# Altium schematic sheet Passvies.SchDoc
size A; SheetNumber: 17; SheetTotal: 17
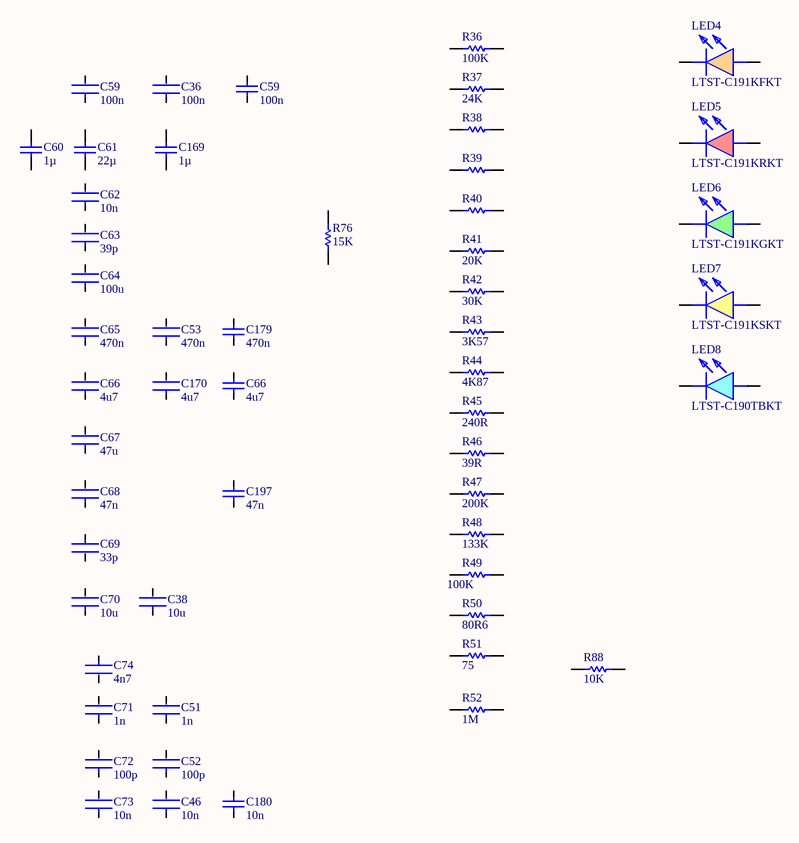
[diagram p0: Passvies.SchDoc]

## Parts
(Parts that share a designator on the sheet are numbered #1, #2 ... from top to bottom, then left to right.)
C36  value 100n  [FP-C1005-050-0_05-IPC_C]  (hidden comment: C1005X7R1H104K050BB)
C38  value 10u  [FP-C1608-080-0_1-IPC_B]  (hidden comment: C1608JB0J106K080AB)
C46  value 10n  [FP-C1005-050-0_05-IPC_C]  (hidden comment: C1005X7S2A103K050BB)
C51  value 1n  [FP-C1005-050-0_05-IPC_C]  (hidden comment: C1005C0G2A102J050BC)
C52  value 100p  [FP-C1005-050-0_05-IPC_C]  (hidden comment: C1005C0G1H101J050BA)
C53  value 470n  [FP-C1005-050-0_05-IPC_C]  (hidden comment: C1005X5R1E474K050BB)
C59#1  value 100n  [FP-C1005-050-0_05-IPC_B]  (hidden comment: C1005X7R1H104K050BB)
C59#2  value 100n  [FP-C1005-050-0_05-IPC_C]  (hidden comment: C1005X7R1H104K050BB)
C60  value 1µ  [CAPC1005X55X10NL05]  (hidden comment: C1005X5R1A105K050BB)
C61  value 22µ  [CAPC1608X100X20NL10]  (hidden comment: C1608X5R0J226M080AC)
C62  value 10n  [FP-C1005-050-0_05-IPC_B]  (hidden comment: C1005X7R1H103K050BB)
C63  value 39p  [FP-C1005-050-0_05-IPC_B]  (hidden comment: C1005C0G1H390J050BA)
C64  value 100u  [FP-C3216-160-0_3-IPC_B]  (hidden comment: C3216X5R0G107M160AB)
C65  value 470n  [FP-C1005-050-0_05-IPC_B]  (hidden comment: C1005X5R1E474K050BB)
C66#1  value 4u7  [FP-C1005-050-0_20-0_10-MFG]  (hidden comment: C1005X5R1A475K050BE)
C66#2  value 4u7  [FP-C1005-050-0_20-0_10-IPC_C]  (hidden comment: C1005X5R1A475K050BE)
C67  value 47u  [FP-C2012-125-0_2-IPC_B]  (hidden comment: C2012X5R1A476M125AC)
C68  value 47n  [FP-C1005-050-0_05-IPC_B]  (hidden comment: C1005X7R1H473K050BB)
C69  value 33p  [FP-C1005-050-0_05-IPC_C]  (hidden comment: C1005NP01H330J050BA)
C70  value 10u  [FP-C1608-080-0_1-IPC_B]  (hidden comment: C1608JB0J106K080AB)
C71  value 1n  [FP-C1005-050-0_05-IPC_B]  (hidden comment: C1005C0G2A102J050BC)
C72  value 100p  [FP-C1005-050-0_05-MFG]  (hidden comment: C1005C0G1H101J050BA)
C73  value 10n  [FP-C1005-050-0_05-IPC_B]  (hidden comment: C1005X7S2A103K050BB)
C74  value 4n7  [FP-C1005-050-0_05-IPC_B]  (hidden comment: C1005X7R1H472K050BA)
C169  value 1µ  [CAPC1005X55X10NL05]  (hidden comment: C1005X5R1A105K050BB)
C170  value 4u7  [FP-C1005-050-0_20-0_10-IPC_C]  (hidden comment: C1005X5R1A475K050BE)
C179  value 470n  [FP-C1005-050-0_05-IPC_C]  (hidden comment: C1005X5R1E474K050BB)
C180  value 10n  [FP-C1005-050-0_05-IPC_C]  (hidden comment: C1005X7S2A103K050BB)
C197  value 47n  [FP-C1005-050-0_05-IPC_C]  (hidden comment: C1005X7R1H473K050BB)
LED4  LTST-C191KFKT  [LEDC1608X55N]
LED5  LTST-C191KRKT  [LEDC1608X55N]
LED6  LTST-C191KGKT  [LEDC1608X55N]
LED7  LTST-C191KSKT  [LEDC1608X65N]
LED8  LTST-C190TBKT  [LEDC1608X65N]
R36  value 100K  [RESC1005X40X25NL05T10]  (hidden comment: RC0402FR-07100KL)
R37  value 24K  [RESC1005X40X25LL05T10]  (hidden comment: RC0402FR-0724KL)
R38  RC0402FR-074K99L  [RESC1005X40X25LL05T10]  (value not drawn)
R39  RC0402FR-072K2L  [RESC1005X40X25NL05T10]  (value not drawn)
R40  RC0402FR-071K3L  [RESC1005X40X25ML05T10]  (value not drawn)
R41  value 20K  [RESC1005X40X25LL05T10]  (hidden comment: RC0402FR-0720KL)
R42  value 30K  [RESC1005X40X25LL05T10]  (hidden comment: RC0402FR-0730KL)
R43  value 3K57  [RESC1005X40X25NL05T10]  (hidden comment: RC0402FR-073K57L)
R44  value 4K87  [RESC1005X40X25LL05T10]  (hidden comment: RC0402FR-074K87L)
R45  value 240R  [RESC0402(1005)_N]  (hidden comment: RC0402FR-07240RL)
R46  value 39R  [RESC1005X40X25LL05T10]  (hidden comment: RC0402FR-0739RL)
R47  value 200K  [RESC1005X40X25LL05T10]  (hidden comment: RC0402FR-07200KL)
R48  value 133K  [RESC1005X40X25ML05T10]  (hidden comment: RC0402FR-07133KL)
R49  value 100K  [RESC1005X40X25NL05T10]  (hidden comment: RC0402FR-07100KL)
R50  value 80R6  [RESC1005X40X25LL05T10]  (hidden comment: RC0402FR-0780R6L)
R51  value 75  [RESC1005X40X25LL05T10]  (hidden comment: RC0402FR-0775RL)
R52  value 1M  [RESC1005X40X25NL05T10]  (hidden comment: RC0402FR-071ML)
R76  value 15K  [RESC1005X40X25NL05T10]  (hidden comment: RC0402FR0715KL)
R88  value 10K  [RESC1005X40X25LL05T10]  (hidden comment: RC0402FR-0710KL)

## Nets

Not connected (* = marked no-connect by the designer): C36 1 2; C38 1 2; C46 1 2; C51 1 2; C52 1 2; C53 1 2; C59#1 1 2; C59#2 1 2; C60 1 2; C61 1 2; C62 1 2; C63 1 2; C64 1 2; C65 1 2; C66#1 1 2; C66#2 1 2; C67 1 2; C68 1 2; C69 1 2; C70 1 2; C71 1 2; C72 1 2; C73 1 2; C74 1 2; C169 1 2; C170 1 2; C179 1 2; C180 1 2; C197 1 2; LED4 1(K) 2(A); LED5 1(K) 2(A); LED6 1(K) 2(A); LED7 1(K) 2(A); LED8 1(K) 2(A); R36 1 2; R37 1 2; R38 1 2; R39 1 2; R40 1 2; R41 1 2; R42 1 2; R43 1 2; R44 1 2; R45 1 2; R46 1 2; R47 1 2; R48 1 2; R49 1 2; R50 1 2; R51 1 2; R52 1 2; R76 1 2; R88 1 2

## Library data of the parts
C36 C59#1 = CMP-2000-05393-2: Multilayer Ceramic Capacitors 100nF ±10% 50V X7R SMD 0402; Voltage: 50V; Dielectric Material: Ceramic; Min Operating Temperature: -55°C; Depth: 0.5mm; Radiation Hardening: No; RoHS Compliant: Yes; Voltage Rating (DC): 50V; Lead Free: Lead Free; Resistor Type: Ceramic; Height: 0.5mm; Dielectric: X7R; Thickness: 0.022inch; Case/Package: 0402; Case Code (Metric): 1005; Termination: SMD/SMT; Packaging: Tape and Reel; Max Operating Temperature: 125°C; Mount: Surface Mount; Package Quantity: 1; Width: 0.02inch; Weight: 2.3E-05oz; Voltage Rating: 50V; Tolerance: 10%; Construction: Flat; Case Code (Imperial): 0402; Length: 1mm; REACH SVHC: No SVHC; Series: C; Part Number: C1005X7R1H104K050BB
C38 C70 = CMP-08246-004001-1: Multilayer Ceramic Capacitors 10μF ±10% 6.3V JB SMD 0603; Case Code (Imperial): 0603; Thickness: 0.035inch; Min Operating Temperature: -25°C; Termination: SMD/SMT; Lead Free: Lead Free; Resistor Type: Ceramic; Width: 0.8mm; Voltage Rating (DC): 6.3V; Package Quantity: 4000; Tolerance: 10%; Length: 0.063inch; Series: C; Height: 0.8mm; Max Operating Temperature: 85°C; Mount: Surface Mount; RoHS Compliant: Yes; Voltage Rating: 6.3V; Case Code (Metric): 1608; Dielectric Material: Ceramic; Case/Package: 0603; Packaging: Tape and Reel
C46 C73 = CMP-08246-005668-1: Multilayer Ceramic Capacitors 10nF ±10% 100V X7S SMD 0402; Dissipation Factor: 5%; Case Code (Imperial): 0402; Packaging: Tape and Reel; Voltage Rating (DC): 100V; Max Operating Temperature: 125°C; Min Operating Temperature: -55°C; Case Code (Metric): 1005; Weight: 2.3E-05oz; Length: 1mm; Width: 0.02inch; Tolerance: 10%; Series: C; Package Quantity: 1; RoHS Compliant: Yes; Voltage: 100V; Resistor Type: Ceramic; Number of Pins: 2; Mount: Surface Mount; Height: 0.5mm; Termination: SMD/SMT; Dielectric: X7S; Dielectric Material: Ceramic; Thickness: 0.022inch; REACH SVHC: No SVHC; Lead Free: Lead Free; Voltage Rating: 100V; Case/Package: 0402; Depth: 0.5mm; Part: *
C51 C71 = CMP-08246-005584-1: Multilayer Ceramic Capacitors 1nF ±5% 100V C0G SMD 0402; Voltage Rating: 100V; Termination: SMD/SMT; Width: 0.5mm; Packaging: Tape and Reel; Max Operating Temperature: 125°C; Length: 0.039inch; Case Code (Metric): 1005; Dielectric: C0G; Height: 0.5mm; Package Quantity: 10000; Weight: 2.3E-05oz; Thickness: 0.022inch; Case/Package: 0402; RoHS Compliant: Yes; Case Code (Imperial): 0402; Min Operating Temperature: -55°C; Mount: Surface Mount; Voltage Rating (DC): 100V; Tolerance: 5%; Part Number: C1005C0G2A102J050BC
C52 C72 = CMP-2000-05991-2: Multilayer Ceramic Capacitors 100pF ±5% 50V C0G SMD 0402; Temperature Coefficient: 30ppm/°C; Packaging: Tape and Reel; Number of Pins: 2; Construction: Flat; Max Operating Temperature: 125°C; Depth: 0.5mm; Radiation Hardening: No; Length: 1mm; Mount: Surface Mount; Thickness: 0.022inch; RoHS Compliant: Yes; Width: 0.5mm; Termination: SMD/SMT; Min Operating Temperature: -55°C; Case/Package: 0402; Tolerance: 5%; Height: 0.5mm; Dielectric: C0G; REACH SVHC: No SVHC; Case Code (Imperial): 0402; Dielectric Material: Ceramic; Voltage Rating: 50V; Package Quantity: 1; Voltage Rating (DC): 50V; Weight: 2.3E-05oz; Series: C; Case Code (Metric): 1005; Voltage: 50V; Lead Free: Lead Free
C53 C65 = CMP-2000-06003-2: Multilayer Ceramic Capacitors 470nF ±10% 25V X5R SMD 0402; Dissipation Factor: 10%; Case Code (Metric): 1005; RoHS Compliant: Yes; Lead Free: Lead Free; Length: 1mm; Case/Package: 0402; Termination: SMD/SMT; Voltage Rating: 25V; Dielectric Material: Ceramic; Dielectric: X5R; Depth: 0.5mm; Series: C; Voltage: 25V; Tolerance: 10%; Packaging: Tape and Reel; Resistor Type: Ceramic; Min Operating Temperature: -55°C; Width: 0.02inch; Thickness: 500um; Package Quantity: 10000; Case Code (Imperial): 0402; Construction: Flat; Height: 0.5mm; REACH SVHC: No SVHC; Radiation Hardening: No; Weight: 2.3E-05oz; Mount: Surface Mount; Voltage Rating (DC): 25V; Max Operating Temperature: 85°C; Part Number: C1005X5R1E474K050BB
C59#2 = C1005X7R1H104K050BB: Multilayer Ceramic Capacitors 100nF ±10% 50V X7R SMD 0402; Voltage: 50V; Dielectric Material: Ceramic; Min Operating Temperature: -55°C; Depth: 0.5mm; Radiation Hardening: No; RoHS Compliant: Yes; Voltage Rating (DC): 50V; Lead Free: Lead Free; Resistor Type: Ceramic; Height: 0.5mm; Dielectric: X7R; Thickness: 0.022inch; Case/Package: 0402; Case Code (Metric): 1005; Termination: SMD/SMT; Packaging: Tape and Reel; Max Operating Temperature: 125°C; Mount: Surface Mount; Package Quantity: 1; Width: 0.02inch; Weight: 2.3E-05oz; Voltage Rating: 50V; Tolerance: 10%; Construction: Flat; Case Code (Imperial): 0402; Length: 1mm; REACH SVHC: No SVHC; Series: C; Part Number: C1005X7R1H104K050BB
C60 C169 = CMP-2000-05996-1: Multilayer Ceramic Chip Capacitor, 1 uF, +/- 10%, 10 V, -55 to 85 degC, 0402 (1005 Metric), RoHS, Tape and Reel; Manufacturer: TDK; PCN Part Number: MLCCPartNumberChange30/Nov/2012; Product Training Modules: CSeriesGeneralApplicationsSEAT,CCV,andTVCLDesignToolsGuidetoReplacinganElectrolyticCapacitorwithanMLCC; Voltage - Rated: 10V; Temperature Coefficient: X5R; Online Catalog: CSeries,GeneralPurpose; Other Names: 445-4114-6; Category: Capacitors; Features: -; Lead Style: -; RoHS Information: RoHSCertificate-MLCC; Manufacturer URL: http://www.tdk.com/; Lead Spacing: -; Thickness (Max): 0.022"(0.55mm); Applications: GeneralPurpose; Tolerance: ±10%; Mounting Technology: SurfaceMount; Mounting Type: SurfaceMount,MLCC; Operating Temperature: -55°C~85°C; Datasheet URL: http://download.siliconexpert.com/pdfs/2015/4/21/15/54/45/779/tdk_/manual/37024850441143360mlcc_commercial_general_en.pdf; Package Reference: 1005; Height - Seated (Max): -; Family: CeramicCapacitors; Datasheet Version: 03/2015; Package Description: 2-Pin Surface Mount Device, Body 1 x 0.5 mm; Packaging: Digi-Reel®; Size / Dimension: 0.039"Lx0.020"W(1.00mmx0.50mm); Standard Package: 1; Package / Case: 0402(1005Metric); Ratings: -; Series: C; Part Number: C1005X5R1A105K050BB
C61 = CMP-2000-05440-1: Chip Capacitor, 22 uF, +/- 20%, 6.3 V, -55 to 85 degC, 1608 (0603 Metric), RoHS, Tape and Reel; PCN Part Number: MLCCPartNumberChange30/Nov/2012; Manufacturer: TDK; Temperature Coefficient: X5R; Product Training Modules: CSeriesGeneralApplicationsSEAT,CCV,andTVCLDesignToolsGuidetoReplacinganElectrolyticCapacitorwithanMLCC; Other Names: 445-8028-1; Voltage - Rated: 6.3V; Design Resources: 20WNon-IsolatedBuckLEDDriverUsingPLLNK460KG; Online Catalog: CSeries,GeneralPurpose; Kits: 445-9003-KIT-ND-KITCAPCERHICAPMLCCSMD; Tolerance: ±20%; Series: C; Thickness (Max): 0.039"(1.00mm); Mounting Type: SurfaceMount,MLCC; Ratings: -; Datasheet Version: Mar-15; Package Reference: 603; Packaging: CutTape(CT); Features: -; Package / Case: 0603(1608Metric); Family: CeramicCapacitors; Lead Spacing: -; RoHS Information: RoHSCertificate-MLCC; Manufacturer URL: http://www.tdk.com/; Lead Style: -; Category: Capacitors; Applications: GeneralPurpose; Package Description: 2-Pin Surface Mount Device, Body 1.6 x 0.8 mm; Standard Package: 1; Datasheet URL: http://www.farnell.com/datasheets/1913358.pdf; Height - Seated (Max): -; Operating Temperature: -55degC~85degC; Size / Dimension: 0.063"Lx0.031"W(1.60mmx0.80mm); Part Number: C1608X5R0J226M080AC
C62 = CMP-08246-003994-1: Multilayer Ceramic Capacitors 10nF ±10% 50V X7R SMD 0402; Dissipation Factor: 5%; Tolerance: 10%; Number of Pins: 2; Dielectric: X7R; Dielectric Material: Ceramic; Voltage: 50V; Min Operating Temperature: -55°C; Resistor Type: Ceramic; Weight: 2.3E-05oz; Series: C; Case Code (Metric): 1005; Height: 0.5mm; Case/Package: 0402; Thickness: 0.022inch; Construction: Flat; Mount: Surface Mount; Package Quantity: 1; Width: 0.02inch; Length: 1mm; REACH SVHC: No SVHC; Case Code (Imperial): 0402; Lead Free: Lead Free; Packaging: Tape and Reel; Max Operating Temperature: 125°C; Termination: SMD/SMT; Depth: 0.5mm; Voltage Rating: 50V; Voltage Rating (DC): 50V; Part Number: C1005X7R1H103K050BB
C63 = CMP-08246-002874-1: Multilayer Ceramic Capacitors 39pF ±5% 50V C0G SMD 0402; Max Operating Temperature: 125°C; Voltage Rating: 50V; Height: 0.5mm; Tolerance: 5%; Width: 0.02inch; Mount: Surface Mount; Thickness: 0.022inch; Package Quantity: 1; Length: 1mm; Voltage Rating (DC): 50V; Case Code (Metric): 1005; Depth: 0.5mm; Series: C; Construction: Flat; Case/Package: 0402; Lead Free: Lead Free; RoHS Compliant: Yes; Termination: SMD/SMT; Radiation Hardening: No; Dielectric Material: Ceramic; Packaging: Tape and Reel; Min Operating Temperature: -55°C; Dielectric: C0G; Case Code (Imperial): 0402; Weight: 2.3E-05oz; Part Number: C1005C0G1H390J050BA
C64 = CMP-08246-005374-1: Multilayer Ceramic Capacitors 100uF ±20% 4V X5R SMD 1206; Dielectric: X5R; Voltage Rating (DC): 4V; Lead Free: Lead Free; Max Operating Temperature: 85°C; Construction: Flat; Termination: SMD/SMT; Mount: Surface Mount; Thickness: 0.071inch; Height: 1.6mm; Width: 0.063inch; Resistor Type: Ceramic; Radiation Hardening: No; Case/Package: 1206; Series: C; Weight: 0.000571oz; Depth: 1.6mm; RoHS Compliant: Yes; Dielectric Material: Ceramic; Package Quantity: 2000; Case Code (Metric): 3216; Length: 3.2mm; Case Code (Imperial): 1206; Tolerance: 20%; Packaging: Tape and Reel; Voltage Rating: 4V; Min Operating Temperature: -55°C; Part Number: C3216X5R0G107M160AB
C66#1 C170 = CMP-08246-007228-1: CAP CER 4.7UF 10V X5R 0402; Tolerance: 10%; Max Operating Temperature: 85°C; Case Code (Metric): 1005; Voltage Rating: 10V; Packaging: Tape and Reel; Case/Package: 0402; Features: Soft Termination; Min Operating Temperature: -55°C; Mount: Surface Mount; Case Code (Imperial): 0402; RoHS Compliant: Yes; Part Number: C1005X5R1A475K050BE
C66#2 = C1005X5R1A475K050BE: CAP CER 4.7UF 10V X5R 0402; Tolerance: 10%; Max Operating Temperature: 85°C; Case Code (Metric): 1005; Voltage Rating: 10V; Packaging: Tape and Reel; Case/Package: 0402; Features: Soft Termination; Min Operating Temperature: -55°C; Mount: Surface Mount; Case Code (Imperial): 0402; RoHS Compliant: Yes; Part Number: C1005X5R1A475K050BE
C67 = CMP-2000-05451-2: Multilayer Ceramic Capacitors 47μF ±20% 10V X5R SMD 0805; RoHS Compliant: Yes; Dielectric: X5R; Case Code (Imperial): 0805; Min Operating Temperature: -55°C; Length: 2mm; Voltage Rating: 10V; Lead Free: Lead Free; Weight: 0.000194oz; Resistor Type: Ceramic; Dielectric Material: Ceramic; Max Operating Temperature: 85°C; Height: 1.25mm; Width: 0.049inch; Depth: 1.25mm; Termination: SMD/SMT; Case/Package: 0805; Voltage Rating (DC): 10V; Voltage: 10V; Thickness: 0.057inch; Tolerance: 20%; REACH SVHC: No SVHC; Package Quantity: 1; Series: C; Case Code (Metric): 2012; Mount: Surface Mount; Packaging: Tape and Reel; Part Number: C2012X5R1A476M125AC
C68 = CMP-2000-06006-2: Multilayer Ceramic Capacitors 47nF ±10% 50V X7R SMD 0402; Dissipation Factor: 5%; Weight: 2.3E-05oz; Max Operating Temperature: 125°C; Package Quantity: 1; Width: 0.02inch; Min Operating Temperature: -55°C; Length: 1mm; Dielectric: X7R; Voltage Rating: 50V; Number of Pins: 2; Lead Free: Lead Free; Voltage: 50V; Dielectric Material: Ceramic; Height: 0.5mm; Case Code (Metric): 1005; Voltage Rating (DC): 50V; Construction: Flat; Termination: SMD/SMT; Case Code (Imperial): 0402; Depth: 0.5mm; Packaging: Tape and Reel; Mount: Surface Mount; Series: C; RoHS Compliant: Yes; Tolerance: 10%; Case/Package: 0402; Thickness: 0.022inch; Radiation Hardening: No; Resistor Type: Ceramic; REACH SVHC: No SVHC; Part Number: C1005X7R1H473K050BB
C69 = CMP-08246-005428-1: Multilayer Ceramic Capacitors 33pF ±5% 50V NP0 SMD 0402; Dielectric: C0G; Case Code (Imperial): 0402; Thickness: 0.022inch; Width: 0.02inch; Case Code (Metric): 1005; Length: 0.039inch; Voltage Rating (DC): 50V; Mount: Surface Mount; Max Operating Temperature: 150°C; Height: 0.5mm; Weight: 2.3E-05oz; Voltage Rating: 50V; Case/Package: 0402; Features: High Temperature; Termination: SMD/SMT; Package Quantity: 10000; RoHS Compliant: Yes; Series: C; Tolerance: 5%; Min Operating Temperature: -55°C; Packaging: Tape and Reel
C74 = CMP-08246-005514-1: Multilayer Ceramic Capacitors 4.7nF ±10% 50V X7R SMD 0402; Lead Free: Lead Free; Tolerance: 10%; Length: 1mm; Construction: Flat; Max Operating Temperature: 125°C; Mount: Surface Mount; Series: C; Case Code (Metric): 1005; Voltage Rating (DC): 50V; Weight: 2.3E-05oz; Case/Package: 0402; Height: 0.5mm; Resistor Type: Ceramic; Package Quantity: 1; Depth: 0.5mm; Termination: SMD/SMT; RoHS Compliant: Yes; Dielectric: X7R; REACH SVHC: No SVHC; Dielectric Material: Ceramic; Min Operating Temperature: -55°C; Number of Pins: 2; Width: 0.02inch; Packaging: Cut Tape; Case Code (Imperial): 0402; Thickness: 0.022inch; Voltage Rating: 50V; Radiation Hardening: No; Part Number: C1005X7R1H472K050BA
C179 = C1005X5R1E474K050BB: Multilayer Ceramic Capacitors 470nF ±10% 25V X5R SMD 0402; Dissipation Factor: 10%; Case Code (Metric): 1005; RoHS Compliant: Yes; Lead Free: Lead Free; Length: 1mm; Case/Package: 0402; Termination: SMD/SMT; Dielectric Material: Ceramic; Dielectric: X5R; Depth: 0.5mm; Series: C; Voltage: 25V; Tolerance: 10%; Packaging: Tape and Reel; Resistor Type: Ceramic; Min Operating Temperature: -55°C; Width: 0.02inch; Thickness: 500um; Package Quantity: 10000; Case Code (Imperial): 0402; Construction: Flat; Height: 0.5mm; REACH SVHC: No SVHC; Radiation Hardening: No; Weight: 2.3E-05oz; Mount: Surface Mount; Voltage Rating (DC): 25V; Max Operating Temperature: 85°C; Part Number: C1005X5R1E474K050BB; Voltage Rating: 25V
C180 = C1005X7S2A103K050BB: Multilayer Ceramic Capacitors 10nF ±10% 100V X7S SMD 0402; Dissipation Factor: 5%; Case Code (Imperial): 0402; Packaging: Tape and Reel; Voltage Rating (DC): 100V; Max Operating Temperature: 125°C; Min Operating Temperature: -55°C; Case Code (Metric): 1005; Weight: 2.3E-05oz; Length: 1mm; Width: 0.02inch; Tolerance: 10%; Series: C; Package Quantity: 1; RoHS Compliant: Yes; Voltage: 100V; Resistor Type: Ceramic; Number of Pins: 2; Mount: Surface Mount; Height: 0.5mm; Termination: SMD/SMT; Dielectric: X7S; Dielectric Material: Ceramic; Thickness: 0.022inch; REACH SVHC: No SVHC; Lead Free: Lead Free; Voltage Rating: 100V; Case/Package: 0402; Depth: 0.5mm; Part: *; Part Number: C1005X7S2A103K050BB
C197 = C1005X7R1H473K050BB: Multilayer Ceramic Capacitors 47nF ±10% 50V X7R SMD 0402; Dissipation Factor: 5%; Weight: 2.3E-05oz; Max Operating Temperature: 125°C; Package Quantity: 1; Width: 0.02inch; Min Operating Temperature: -55°C; Length: 1mm; Dielectric: X7R; Voltage Rating: 50V; Number of Pins: 2; Lead Free: Lead Free; Voltage: 50V; Dielectric Material: Ceramic; Height: 0.5mm; Case Code (Metric): 1005; Voltage Rating (DC): 50V; Construction: Flat; Termination: SMD/SMT; Case Code (Imperial): 0402; Depth: 0.5mm; Packaging: Tape and Reel; Mount: Surface Mount; Series: C; RoHS Compliant: Yes; Tolerance: 10%; Case/Package: 0402; Thickness: 0.022inch; Radiation Hardening: No; Resistor Type: Ceramic; REACH SVHC: No SVHC; Part Number: C1005X7R1H473K050BB
LED4 = LTST-C191KFKT: LED; Manufacturer: Lite-On; Value: Orange; Datasheet Link: https://datasheet.datasheetarchive.com/originals/distributors/Datasheets-305/79307.pdf; Height: 0.55mm; Mouser Part Number: 859-LTST-C191KFKT; Mouser Price/Stock: https://www.mouser.co.uk/ProductDetail/Lite-On/LTST-C191KFKT?qs=1bx9pL%2Fk%252BiAv01YAc0eitQ%3D%3D; Arrow Part Number: LTST-C191KFKT; Arrow Price/Stock: https://www.arrow.com/en/products/ltst-c191kfkt/lite-on-technology.html?utm_currency=USD&region=nac; Part Number: LTST-C191KFKT
LED5 = LTST-C191KRKT: LED; Manufacturer_Name: Lite-On; Datasheet Link: http://www.mouser.com/ds/2/239/S_110_LTST-C191KRKT-539838.pdf; Height: 0.55mm; Mouser Part Number: 859-LTST-C191KRKT; Mouser Price/Stock: https://www.mouser.co.uk/ProductDetail/LITEON/LTST-C191KRKT?qs=BAIUz4Y8PJBLfOhzue0q%252BA%3D%3D; Arrow Part Number: LTST-C191KRKT; Arrow Price/Stock: https://www.arrow.com/en/products/ltst-c191krkt/lite-on-technology?utm_currency=USD&region=nac; Part Number: LTST-C191KRKT
LED6 = LTST-C191KGKT: LED; Manufacturer_Name: Lite-On; Value: Green; Datasheet Link: http://www.mouser.com/ds/2/239/S_110_LTST-C191KGKT-369560.pdf; Height: 0.55mm; Mouser Part Number: 859-LTST-C191KGKT; Mouser Price/Stock: https://www.mouser.co.uk/ProductDetail/Lite-On/LTST-C191KGKT?qs=xSPZu9B1aMCRQ5ACasEYAg%3D%3D; Arrow Part Number: LTST-C191KGKT; Arrow Price/Stock: https://www.arrow.com/en/products/ltst-c191kgkt/lite-on-technology.html?utm_currency=USD&region=europe; Part Number: LTST-C191KGKT
LED7 = LTST-C191KSKT: LED; Manufacturer_Name: Lite-On; Value: Yellow; Datasheet Link: https://optoelectronics.liteon.com/upload/download/DS22-2000-224/LTST-C191KSKT.PDF; Height: 0.65mm; Mouser Part Number: 859-LTST-C191KSKT; Mouser Price/Stock: https://www.mouser.co.uk/ProductDetail/Lite-On/LTST-C191KSKT?qs=%252BOwCA7JpThkCRw1w23EPng%3D%3D; Arrow Part Number: LTST-C191KSKT; Arrow Price/Stock: https://www.arrow.com/en/products/ltst-c191kskt/lite-on-technology.html?utm_currency=USD&region=nac; Part Number: LTST-C191KSKT
LED8 = LTST-C190TBKT: LED; Manufacturer_Name: Lite-On; Value: Blue; Datasheet Link: http://optoelectronics.liteon.com/upload/download/DS-22-99-0224/LTST-C190TBKT.PDF; Height: 0.9mm; Mouser Part Number: 859-LTST-C190TBKT; Mouser Price/Stock: https://www.mouser.co.uk/ProductDetail/Lite-On/LTST-C190TBKT?qs=RX3h6vwoF9jNAGfkgrwfMA%3D%3D; Arrow Part Number: LTST-C190TBKT; Arrow Price/Stock: https://www.arrow.com/en/products/ltst-c190tbkt/lite-on-technology?utm_currency=USD&region=nac; Part Number: LTST-C190TBKT
R36 R49 = CMP-2002-07343-1: Manufacturer: Yageo / Phycomp; Part Number: RC0402FR-07100KL
R37 = CMP-2002-07535-1: Manufacturer: Yageo / Phycomp; Part Number: RC0402FR-0724KL
R38 = CMP-2002-07717-1: Manufacturer: Yageo / Phycomp; Part Number: RC0402FR-074K99L
R39 = CMP-2002-07567-1: Manufacturer: Yageo / Phycomp; Part Number: RC0402FR-072K2L
R40 = CMP-2002-07459-1: Manufacturer: Yageo / Phycomp; Part Number: RC0402FR-071K3L
R41 R42 = CMP-2002-07602-1: Manufacturer: Yageo / Phycomp; Parameter 1: *
  R41: Part Number: RC0402FR-0720KL
  R42: Part Number: RC0402FR-0730KL
R43 = CMP-2002-07655-1: Manufacturer: Yageo; Part Number: RC0402FR-073K57L; Parameter 1: *
R44 = CMP-2002-07716-1: Manufacturer: Yageo / Phycomp; Part Number: RC0402FR-074K87L; Parameter 1: *
R45 = CMP-1011-00438-1: 240R 0.063W 1% 0402 (1005 Metric)  SMD; Case-Metric: 1005; Case-EIA: 0402; Power: 0.063 W; Tolerance: 1 %; Technology: SMT; Part Number: RC0402FR-07240RL; Parameter 1: *
R46 = CMP-1011-00350-2: Manufacturer: Yageo / Phycomp; Part Number: RC0402FR-0739RL; Parameter 1: *
R47 = CMP-2002-07497-1: Manufacturer: Yageo / Phycomp; Part Number: RC0402FR-07200KL; Parameter 1: *
R48 = CMP-2002-07383-1: Manufacturer: Yageo / Phycomp; Part Number: RC0402FR-07133KL; Parameter 1: *
R50 = CMP-1011-00386-2: Manufacturer: Yageo; Part Number: RC0402FR-0780R6L; Parameter 1: *
R51 = CMP-2002-07798-1: Manufacturer: Yageo / Phycomp; Part Number: RC0402FR-0775RL
R52 = CMP-2002-07490-1: Manufacturer: Yageo / Phycomp; Part Number: RC0402FR-071ML
R76 = CMP-2002-07410-1: Manufacturer: Yageo / Phycomp; Part Number: RC0402FR0715KL
R88 = CMP-2002-07353-1: Manufacturer: Yageo / Phycomp; Part Number: RC0402FR-0710KL